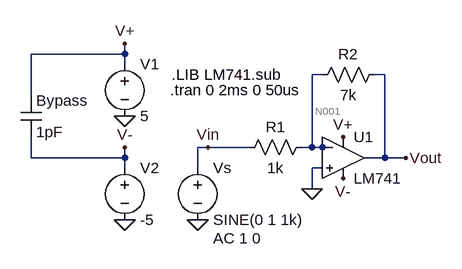
[diagram p0: schematic PL6.asc]
PL6.asc, the LTspice schematic file:
Version 4
SHEET 1 880 680
WIRE -80 0 -80 -16
WIRE -80 0 -224 0
WIRE -80 16 -80 0
WIRE 224 32 208 32
WIRE 320 32 304 32
WIRE -224 64 -224 0
WIRE 48 144 32 144
WIRE 112 144 48 144
WIRE 208 144 208 32
WIRE 208 144 192 144
WIRE 224 144 224 128
WIRE 224 144 208 144
WIRE -224 160 -224 128
WIRE -80 160 -80 144
WIRE -80 160 -224 160
WIRE 320 160 320 32
WIRE 320 160 288 160
WIRE 352 160 320 160
WIRE -80 176 -80 160
WIRE 32 176 32 144
WIRE 224 176 208 176
WIRE 208 208 208 176
FLAG 256 128 V+
FLAG 256 192 V-
FLAG 352 160 Vout
FLAG 208 208 0
FLAG 32 256 0
FLAG -80 256 0
FLAG -80 96 0
FLAG 48 144 Vin
FLAG -80 -16 V+
FLAG -80 144 V-
SYMBOL Opamps\\opamp2 256 96 R0
SYMATTR InstName U1
SYMATTR Value LM741
SYMBOL res 320 16 R90
WINDOW 0 0 56 VBottom 2
WINDOW 3 32 56 VTop 2
SYMATTR InstName R2
SYMATTR Value 7k
SYMBOL res 208 128 R90
WINDOW 0 0 56 VBottom 2
WINDOW 3 32 56 VTop 2
SYMATTR InstName R1
SYMATTR Value 1k
SYMBOL voltage 32 160 R0
WINDOW 123 24 124 Left 2
WINDOW 39 0 0 Left 2
SYMATTR InstName Vs
SYMATTR Value SINE(0 1 1k)
SYMATTR Value2 AC 1 0
SYMBOL voltage -80 160 R0
WINDOW 123 0 0 Left 2
WINDOW 39 0 0 Left 2
SYMATTR InstName V2
SYMATTR Value -5
SYMBOL voltage -80 0 R0
WINDOW 123 0 0 Left 2
WINDOW 39 0 0 Left 2
SYMATTR InstName V1
SYMATTR Value 5
SYMBOL cap -240 64 R0
SYMATTR InstName Bypass
SYMATTR Value 1pF
TEXT -8 32 Left 2 !.LIB LM741.sub
TEXT -10 56 Left 2 !.tran 0 2ms 0 50us

The netlist it stands for:
* PL6.asc
XU1 0 N001 V+ V- Vout LM741  ; pins In+ In- V+ V- OUT
R2 Vout N001 7k
R1 N001 Vin 1k
Vs Vin 0 SINE(0 1 1k) AC 1 0
V2 V- 0 -5
V1 V+ 0 5
C§Bypass V+ V- 1pF
.LIB LM741.sub
.tran 0 2ms 0 50us
.backanno
.end

* Results of the author's LTspice run, read from the files saved beside the schematic
* Operating Point, zero values left out:
*   V(n001) = 1 mV
*   V(v-) = -5 V
*   V(v+) = 5 V
*   V(vout) = 8.713 mV
*   I(R1) = 1 µA
*   I(R2) = 1.102 µA
*   I(V1) = -1.452 mA
*   I(V2) = 1.451 mA
*   I(Vs) = 1 µA
*   Ix(u1:1) = 57.87 nA
*   Ix(u1:2) = 101.9 nA
*   Ix(u1:99) = 1.452 mA
*   Ix(u1:50) = -1.451 mA
*   Ix(u1:28) = -1.102 µA
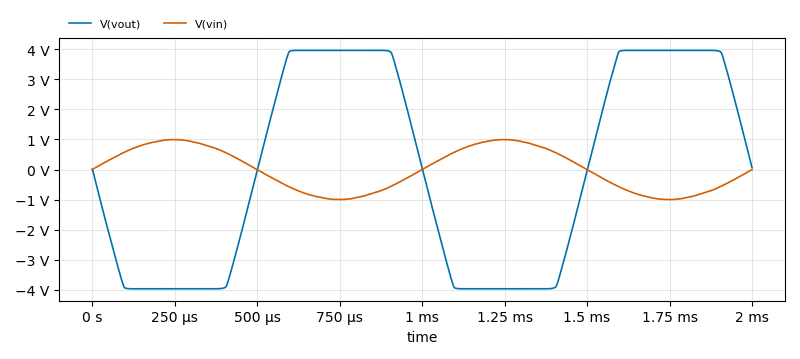
[diagram p1: Transient Analysis of PL6.asc, plotted from the saved traces]
* Transient Analysis, 1 run:
*   V(vout): min -3.961 V, max 3.961 V, average 3.457 mV, rms 3.444 V, last 66.95 mV
*   V(vin): min -996.4 mV, max 996.5 mV, average -23.77 µV, rms 702.9 mV, last 0 V